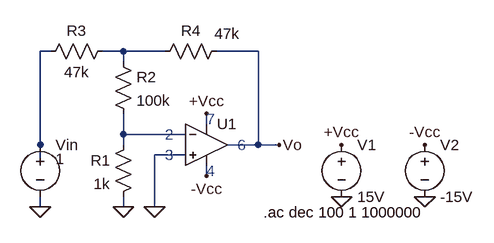
[diagram p0: schematic Open-Loop Gain.asc]
Open-Loop Gain.asc, the LTspice schematic file:
Version 4
SHEET 1 880 680
WIRE 64 192 48 192
WIRE 176 192 144 192
WIRE 240 192 176 192
WIRE 384 192 320 192
WIRE 176 208 176 192
WIRE 304 304 304 288
WIRE 176 320 176 288
WIRE 272 320 176 320
WIRE 48 336 48 192
WIRE 176 336 176 320
WIRE 384 336 384 192
WIRE 384 336 336 336
WIRE 416 336 384 336
WIRE 272 352 224 352
WIRE 48 368 48 336
WIRE 304 384 304 368
WIRE 48 432 48 416
WIRE 176 432 176 416
WIRE 224 432 224 352
FLAG 512 416 0
FLAG 640 416 0
FLAG 512 336 +Vcc
FLAG 640 336 -Vcc
FLAG 304 288 +Vcc
FLAG 304 384 -Vcc
FLAG 416 336 Vo
FLAG 224 432 0
FLAG 176 432 0
FLAG 48 432 0
SYMBOL OpAmps/UniversalOpAmp 304 336 R0
SYMATTR InstName U1
SYMBOL Voltage 512 320 R0
SYMATTR InstName V1
SYMATTR Value 15V
SYMBOL Voltage 640 320 R0
SYMATTR InstName V2
SYMATTR Value -15V
SYMBOL Res 336 176 R90
WINDOW 0 0 56 VBottom 2
WINDOW 3 -27 0 VTop 2
SYMATTR InstName R4
SYMATTR Value 47k
SYMBOL Res 160 176 R90
WINDOW 0 0 56 VBottom 2
WINDOW 3 32 56 VTop 2
SYMATTR InstName R3
SYMATTR Value 47k
SYMBOL Res 160 192 R0
SYMATTR InstName R2
SYMATTR Value 100k
SYMBOL Res 192 320 M0
SYMATTR InstName R1
SYMATTR Value 1k
SYMBOL Voltage 48 320 R0
WINDOW 3 24 38 Left 2
SYMATTR InstName Vin
SYMATTR Value 1
TEXT 304 376 Left 2 ;4
TEXT 304 296 Left 2 ;7
TEXT 352 336 Left 2 ;6
TEXT 240 320 Left 2 ;2
TEXT 240 352 Left 2 ;3
TEXT 392 440 Left 2 !.ac dec 100 1 1000000

The netlist it stands for:
* Open-Loop Gain.asc
XU1 0 N003 +Vcc -Vcc Vo level1 Avol=1Meg GBW=10Meg Vos=0 En=0 Enk=0 In=0 Ink=0 Rin=500Meg  ; pins In+ In- V+ V- OUT
V1 +Vcc 0 15V
V2 -Vcc 0 -15V
R4 Vo N002 47k
R3 N002 N001 47k
R2 N002 N003 100k
R1 N003 0 1k
Vin N001 0 1
* 4
* 7
* 6
* 2
* 3
.ac dec 100 1 1000000
.lib UniversalOpAmp1.lib
.backanno
.end